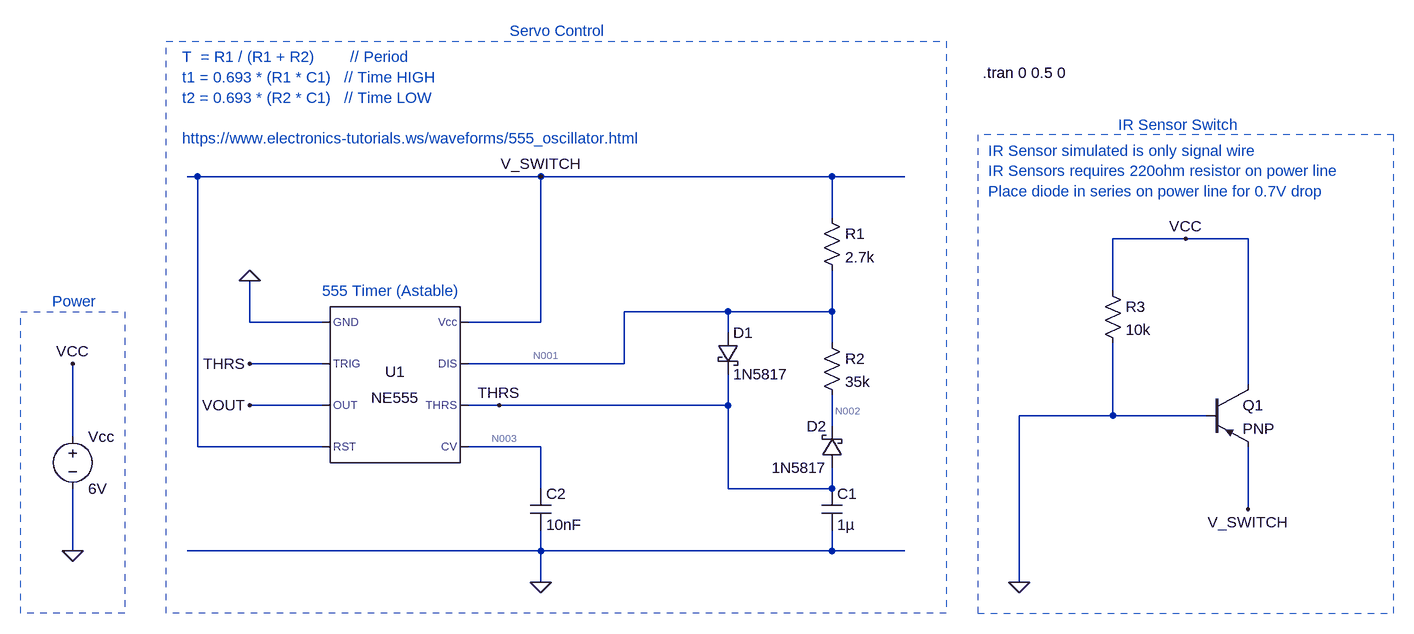
[diagram p0: schematic Hopper.asc]
Hopper.asc, the LTspice schematic file:
Version 4
SHEET 1 2312 996
WIRE -208 -208 -224 -208
WIRE 320 -208 -208 -208
WIRE 768 -208 320 -208
WIRE 880 -208 768 -208
WIRE 768 -144 768 -208
WIRE 1312 -112 1200 -112
WIRE 1408 -112 1312 -112
WIRE 1200 -32 1200 -112
WIRE 608 0 448 0
WIRE 768 0 768 -64
WIRE 768 0 608 0
WIRE -128 16 -128 -48
WIRE -16 16 -128 16
WIRE 320 16 320 -208
WIRE 320 16 208 16
WIRE 608 32 608 0
WIRE 768 48 768 0
WIRE -16 80 -128 80
WIRE 448 80 448 0
WIRE 448 80 208 80
WIRE 1408 112 1408 -112
WIRE -16 144 -128 144
WIRE 256 144 208 144
WIRE 608 144 608 96
WIRE 608 144 256 144
WIRE 1200 160 1200 48
WIRE 1200 160 1056 160
WIRE 1344 160 1200 160
WIRE 768 176 768 128
WIRE -400 192 -400 80
WIRE -208 208 -208 -208
WIRE -16 208 -208 208
WIRE 320 208 208 208
WIRE 320 272 320 208
WIRE 608 272 608 144
WIRE 768 272 768 240
WIRE 768 272 608 272
WIRE 1408 304 1408 208
WIRE -400 368 -400 272
WIRE 320 368 320 336
WIRE 320 368 -224 368
WIRE 768 368 768 336
WIRE 768 368 320 368
WIRE 880 368 768 368
WIRE 320 416 320 368
WIRE 1056 416 1056 160
FLAG -400 368 0
FLAG -400 80 VCC
FLAG -128 -48 0
FLAG -128 144 VOUT
FLAG -128 80 THRS
FLAG 1408 304 V_SWITCH
FLAG 1056 416 0
FLAG 320 -208 V_SWITCH
FLAG 320 416 0
FLAG 256 144 THRS
FLAG 1312 -112 VCC
SYMBOL voltage -400 176 R0
WINDOW 123 0 0 Left 0
WINDOW 39 0 0 Left 0
SYMATTR InstName Vcc
SYMATTR Value 6V
SYMBOL Misc\\NE555 96 112 R0
SYMATTR InstName U1
SYMBOL res 752 -160 R0
SYMATTR InstName R1
SYMATTR Value 2.7k
SYMBOL res 752 32 R0
SYMATTR InstName R2
SYMATTR Value 35k
SYMBOL cap 752 272 R0
SYMATTR InstName C1
SYMATTR Value 1µ
SYMBOL cap 304 272 R0
SYMATTR InstName C2
SYMATTR Value 10nF
SYMBOL schottky 592 32 R0
SYMATTR InstName D1
SYMATTR Value 1N5817
SYMATTR Description Diode
SYMATTR Type diode
SYMBOL schottky 784 240 R180
WINDOW 0 24 64 Left 2
WINDOW 3 24 0 Left 2
SYMATTR InstName D2
SYMATTR Value 1N5817
SYMATTR Description Diode
SYMATTR Type diode
SYMBOL res 1184 -48 R0
SYMATTR InstName R3
SYMATTR Value 10k
SYMBOL pnp 1344 112 R0
SYMATTR InstName Q1
TEXT -432 -16 Left 2 ;Power
TEXT 272 -432 Left 2 ;Servo Control
TEXT -232 -392 Left 2 ;T  = R1 / (R1 + R2)        // Period\nt1 = 0.693 * (R1 * C1)   // Time HIGH\nt2 = 0.693 * (R2 * C1)   // Time LOW\n \nhttps://www.electronics-tutorials.ws/waveforms/555_oscillator.html
TEXT 1208 -288 Left 2 ;IR Sensor Switch
TEXT 1008 -248 Left 2 ;IR Sensor simulated is only signal wire\nIR Sensors requires 220ohm resistor on power line\nPlace diode in series on power line for 0.7V drop
TEXT 1000 -368 Left 2 !.tran 0 0.5 0
TEXT -16 -32 Left 2 ;555 Timer (Astable)
RECTANGLE Normal -320 464 -480 0 2
RECTANGLE Normal 944 464 -256 -416 2
RECTANGLE Normal 1632 -272 992 464 2

The netlist it stands for:
* Hopper.asc
Vcc VCC 0 6V
XU1 0 THRS VOUT V_SWITCH N003 THRS N001 V_SWITCH NE555  ; pins GND TRIG OUT RST CV THRS DIS Vcc
R1 V_SWITCH N001 2.7k
R2 N001 N002 35k
C1 THRS 0 1µ
C2 N003 0 10nF
D1 N001 THRS 1N5817
D2 THRS N002 1N5817
R3 VCC 0 10k
Q1 VCC 0 V_SWITCH 0 PNP
.model D D
.lib standard.dio
.model NPN NPN
.model PNP PNP
.lib standard.bjt
* Power
* Servo Control
* T  = R1 / (R1 + R2)        // Period
* t1 = 0.693 * (R1 * C1)   // Time HIGH
* t2 = 0.693 * (R2 * C1)   // Time LOW
* https://www.electronics-tutorials.ws/waveforms/555_oscillator.html
* IR Sensor Switch
* IR Sensor simulated is only signal wire
* IR Sensors requires 220ohm resistor on power line
* Place diode in series on power line for 0.7V drop
.tran 0 0.5 0
* 555 Timer (Astable)
.lib NE555.sub
.backanno
.end

* Results of the author's LTspice run, read from the files saved beside the schematic
* Operating Point, zero values left out:
*   V(vcc) = 6 V
*   V(thrs) = 5.956 V
*   V(n003) = 3.971 V
*   V(v_switch) = 5.956 V
*   V(n001) = 5.956 V
*   V(vout) = 5.956 V
*   V(n002) = 5.956 V
*   Ic(Q1) = 4.497 TA
*   Ib(Q1) = -4.497 TA
*   Ie(Q1) = -2.22 mA
*   I(D1) = 11.55 nA
*   I(D2) = -358.3 pA
*   I(R1) = 19.86 nA
*   I(R2) = 358.3 pA
*   I(R3) = 600 µA
*   I(Vcc) = -4.497 TA
*   Ix(u1:1) = -1.921 mA
*   Ix(u1:2) = 5.956 nA
*   Ix(u1:4) = 29.04 µA
*   Ix(u1:6) = 5.956 nA
*   Ix(u1:7) = 7.947 nA
*   Ix(u1:8) = 1.892 mA
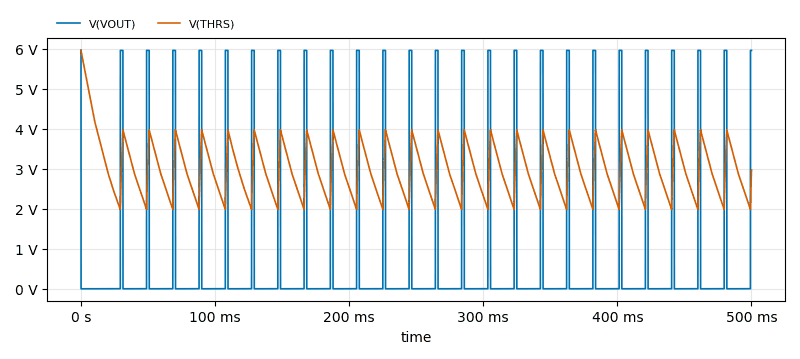
[diagram p1: Transient Analysis of Hopper.asc, plotted from the saved traces]
* Transient Analysis, 1 run:
*   V(VOUT): min 35.74 µV, max 5.956 V, average 569 mV, rms 1.841 V, last 5.956 V
*   V(THRS): min 1.984 V, max 5.956 V, average 2.976 V, rms 3.07 V, last 2.97 V